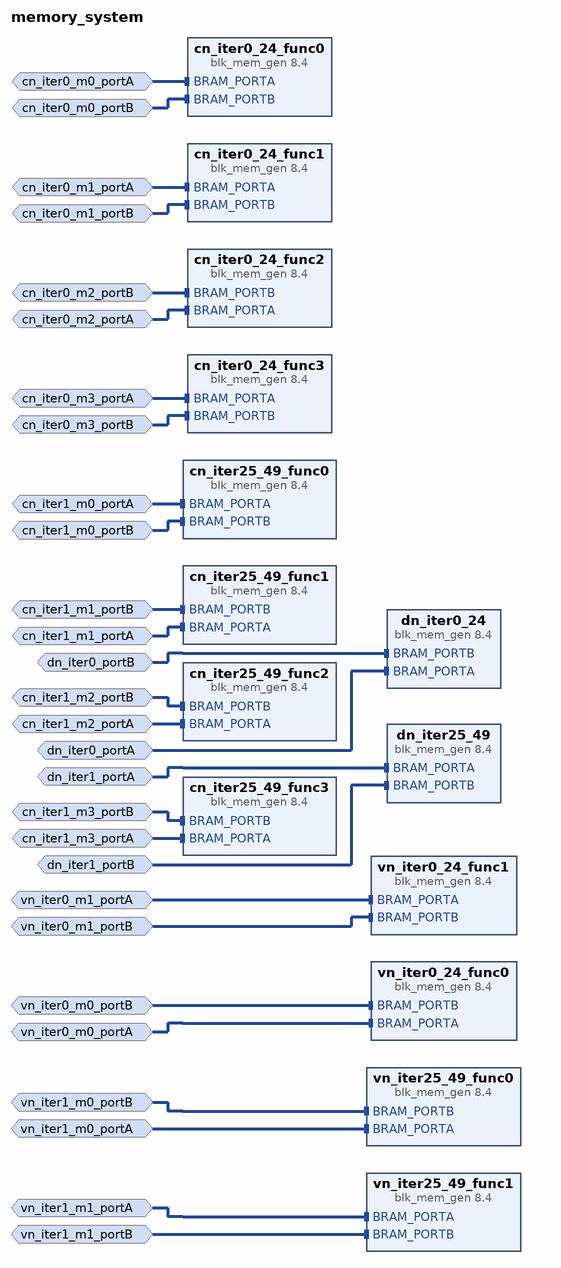
[diagram p0: block diagram of the top level]
# Vivado block design memory_system, xczu7ev-ffvc1156-2-e, Vivado 2019.2
create_bd_design memory_system

create_bd_intf_port -mode Slave -vlnv xilinx.com:interface:bram_rtl:1.0 cn_iter0_m0_portA
create_bd_intf_port -mode Slave -vlnv xilinx.com:interface:bram_rtl:1.0 cn_iter0_m0_portB
create_bd_intf_port -mode Slave -vlnv xilinx.com:interface:bram_rtl:1.0 cn_iter0_m1_portA
create_bd_intf_port -mode Slave -vlnv xilinx.com:interface:bram_rtl:1.0 cn_iter0_m1_portB
create_bd_intf_port -mode Slave -vlnv xilinx.com:interface:bram_rtl:1.0 cn_iter0_m2_portA
create_bd_intf_port -mode Slave -vlnv xilinx.com:interface:bram_rtl:1.0 cn_iter0_m2_portB
create_bd_intf_port -mode Slave -vlnv xilinx.com:interface:bram_rtl:1.0 cn_iter0_m3_portA
create_bd_intf_port -mode Slave -vlnv xilinx.com:interface:bram_rtl:1.0 cn_iter0_m3_portB
create_bd_intf_port -mode Slave -vlnv xilinx.com:interface:bram_rtl:1.0 cn_iter1_m0_portA
set_property -dict {CONFIG.READ_WRITE_MODE READ_ONLY} [get_bd_intf_ports cn_iter1_m0_portA]
create_bd_intf_port -mode Slave -vlnv xilinx.com:interface:bram_rtl:1.0 cn_iter1_m0_portB
set_property -dict {CONFIG.READ_WRITE_MODE READ_ONLY} [get_bd_intf_ports cn_iter1_m0_portB]
create_bd_intf_port -mode Slave -vlnv xilinx.com:interface:bram_rtl:1.0 cn_iter1_m1_portA
set_property -dict {CONFIG.READ_WRITE_MODE READ_ONLY} [get_bd_intf_ports cn_iter1_m1_portA]
create_bd_intf_port -mode Slave -vlnv xilinx.com:interface:bram_rtl:1.0 cn_iter1_m1_portB
set_property -dict {CONFIG.READ_WRITE_MODE READ_ONLY} [get_bd_intf_ports cn_iter1_m1_portB]
create_bd_intf_port -mode Slave -vlnv xilinx.com:interface:bram_rtl:1.0 cn_iter1_m2_portA
set_property -dict {CONFIG.READ_WRITE_MODE READ_ONLY} [get_bd_intf_ports cn_iter1_m2_portA]
create_bd_intf_port -mode Slave -vlnv xilinx.com:interface:bram_rtl:1.0 cn_iter1_m2_portB
set_property -dict {CONFIG.READ_WRITE_MODE READ_ONLY} [get_bd_intf_ports cn_iter1_m2_portB]
create_bd_intf_port -mode Slave -vlnv xilinx.com:interface:bram_rtl:1.0 cn_iter1_m3_portA
set_property -dict {CONFIG.READ_WRITE_MODE READ_ONLY} [get_bd_intf_ports cn_iter1_m3_portA]
create_bd_intf_port -mode Slave -vlnv xilinx.com:interface:bram_rtl:1.0 cn_iter1_m3_portB
set_property -dict {CONFIG.READ_WRITE_MODE READ_ONLY} [get_bd_intf_ports cn_iter1_m3_portB]
create_bd_intf_port -mode Slave -vlnv xilinx.com:interface:bram_rtl:1.0 dn_iter0_portA
set_property -dict {CONFIG.READ_WRITE_MODE READ_ONLY} [get_bd_intf_ports dn_iter0_portA]
create_bd_intf_port -mode Slave -vlnv xilinx.com:interface:bram_rtl:1.0 dn_iter0_portB
set_property -dict {CONFIG.READ_WRITE_MODE READ_ONLY} [get_bd_intf_ports dn_iter0_portB]
create_bd_intf_port -mode Slave -vlnv xilinx.com:interface:bram_rtl:1.0 dn_iter1_portA
set_property -dict {CONFIG.READ_WRITE_MODE READ_ONLY} [get_bd_intf_ports dn_iter1_portA]
create_bd_intf_port -mode Slave -vlnv xilinx.com:interface:bram_rtl:1.0 dn_iter1_portB
set_property -dict {CONFIG.READ_WRITE_MODE READ_ONLY} [get_bd_intf_ports dn_iter1_portB]
create_bd_intf_port -mode Slave -vlnv xilinx.com:interface:bram_rtl:1.0 vn_iter0_m0_portA
set_property -dict {CONFIG.READ_WRITE_MODE READ_ONLY} [get_bd_intf_ports vn_iter0_m0_portA]
create_bd_intf_port -mode Slave -vlnv xilinx.com:interface:bram_rtl:1.0 vn_iter0_m0_portB
set_property -dict {CONFIG.READ_WRITE_MODE READ_ONLY} [get_bd_intf_ports vn_iter0_m0_portB]
create_bd_intf_port -mode Slave -vlnv xilinx.com:interface:bram_rtl:1.0 vn_iter0_m1_portA
set_property -dict {CONFIG.READ_WRITE_MODE READ_ONLY} [get_bd_intf_ports vn_iter0_m1_portA]
create_bd_intf_port -mode Slave -vlnv xilinx.com:interface:bram_rtl:1.0 vn_iter0_m1_portB
set_property -dict {CONFIG.READ_WRITE_MODE READ_ONLY} [get_bd_intf_ports vn_iter0_m1_portB]
create_bd_intf_port -mode Slave -vlnv xilinx.com:interface:bram_rtl:1.0 vn_iter1_m0_portA
set_property -dict {CONFIG.READ_WRITE_MODE READ_ONLY} [get_bd_intf_ports vn_iter1_m0_portA]
create_bd_intf_port -mode Slave -vlnv xilinx.com:interface:bram_rtl:1.0 vn_iter1_m0_portB
set_property -dict {CONFIG.READ_WRITE_MODE READ_ONLY} [get_bd_intf_ports vn_iter1_m0_portB]
create_bd_intf_port -mode Slave -vlnv xilinx.com:interface:bram_rtl:1.0 vn_iter1_m1_portA
set_property -dict {CONFIG.READ_WRITE_MODE READ_ONLY} [get_bd_intf_ports vn_iter1_m1_portA]
create_bd_intf_port -mode Slave -vlnv xilinx.com:interface:bram_rtl:1.0 vn_iter1_m1_portB
set_property -dict {CONFIG.READ_WRITE_MODE READ_ONLY} [get_bd_intf_ports vn_iter1_m1_portB]

create_bd_cell -type ip -vlnv xilinx.com:ip:blk_mem_gen:8.4 cn_iter0_24_func0
set_property -dict [list \
  CONFIG.Algorithm Minimum_Area \
  CONFIG.Assume_Synchronous_Clk true \
  CONFIG.Coe_File ../../../../../../../../python_prj/COE_BRAM32.CNU/Iter_0_24/lut_Iter0_24_Func0.coe \
  CONFIG.Enable_32bit_Address false \
  CONFIG.Enable_A Always_Enabled \
  CONFIG.Enable_B Always_Enabled \
  CONFIG.Load_Init_File true \
  CONFIG.Memory_Type Dual_Port_ROM \
  CONFIG.Port_A_Write_Rate 0 \
  CONFIG.Port_B_Clock 100 \
  CONFIG.Port_B_Enable_Rate 100 \
  CONFIG.RD_ADDR_CHNG_A false \
  CONFIG.Read_Width_B 6 \
  CONFIG.Register_PortA_Output_of_Memory_Primitives false \
  CONFIG.Register_PortB_Output_of_Memory_Primitives false \
  CONFIG.Use_RSTA_Pin false \
  CONFIG.Write_Depth_A 800 \
  CONFIG.Write_Width_A 6 \
  CONFIG.Write_Width_B 6 \
  CONFIG.use_bram_block Stand_Alone \
] [get_bd_cells cn_iter0_24_func0]
create_bd_cell -type ip -vlnv xilinx.com:ip:blk_mem_gen:8.4 cn_iter0_24_func1
set_property -dict [list \
  CONFIG.Algorithm Minimum_Area \
  CONFIG.Assume_Synchronous_Clk true \
  CONFIG.Coe_File ../../../../../../../../python_prj/COE_BRAM32.CNU/Iter_0_24/lut_Iter0_24_Func1.coe \
  CONFIG.Enable_32bit_Address false \
  CONFIG.Enable_A Always_Enabled \
  CONFIG.Enable_B Always_Enabled \
  CONFIG.Load_Init_File true \
  CONFIG.Memory_Type Dual_Port_ROM \
  CONFIG.Port_A_Write_Rate 0 \
  CONFIG.Port_B_Clock 100 \
  CONFIG.Port_B_Enable_Rate 100 \
  CONFIG.RD_ADDR_CHNG_A false \
  CONFIG.Read_Width_B 6 \
  CONFIG.Register_PortA_Output_of_Memory_Primitives false \
  CONFIG.Register_PortB_Output_of_Memory_Primitives false \
  CONFIG.Use_RSTA_Pin false \
  CONFIG.Write_Depth_A 800 \
  CONFIG.Write_Width_A 6 \
  CONFIG.Write_Width_B 6 \
  CONFIG.use_bram_block Stand_Alone \
] [get_bd_cells cn_iter0_24_func1]
create_bd_cell -type ip -vlnv xilinx.com:ip:blk_mem_gen:8.4 cn_iter0_24_func2
set_property -dict [list \
  CONFIG.Algorithm Minimum_Area \
  CONFIG.Assume_Synchronous_Clk true \
  CONFIG.Coe_File ../../../../../../../../python_prj/COE_BRAM32.CNU/Iter_0_24/lut_Iter0_24_Func2.coe \
  CONFIG.Enable_32bit_Address false \
  CONFIG.Enable_A Always_Enabled \
  CONFIG.Enable_B Always_Enabled \
  CONFIG.Load_Init_File true \
  CONFIG.Memory_Type Dual_Port_ROM \
  CONFIG.Port_A_Write_Rate 0 \
  CONFIG.Port_B_Clock 100 \
  CONFIG.Port_B_Enable_Rate 100 \
  CONFIG.RD_ADDR_CHNG_A false \
  CONFIG.Read_Width_B 6 \
  CONFIG.Register_PortA_Output_of_Memory_Primitives false \
  CONFIG.Register_PortB_Output_of_Memory_Primitives false \
  CONFIG.Use_RSTA_Pin false \
  CONFIG.Write_Depth_A 800 \
  CONFIG.Write_Width_A 6 \
  CONFIG.Write_Width_B 6 \
  CONFIG.use_bram_block Stand_Alone \
] [get_bd_cells cn_iter0_24_func2]
create_bd_cell -type ip -vlnv xilinx.com:ip:blk_mem_gen:8.4 cn_iter0_24_func3
set_property -dict [list \
  CONFIG.Algorithm Minimum_Area \
  CONFIG.Assume_Synchronous_Clk true \
  CONFIG.Coe_File ../../../../../../../../python_prj/COE_BRAM32.CNU/Iter_0_24/lut_Iter0_24_Func3.coe \
  CONFIG.Enable_32bit_Address false \
  CONFIG.Enable_A Always_Enabled \
  CONFIG.Enable_B Always_Enabled \
  CONFIG.Load_Init_File true \
  CONFIG.Memory_Type Dual_Port_ROM \
  CONFIG.Port_A_Write_Rate 0 \
  CONFIG.Port_B_Clock 100 \
  CONFIG.Port_B_Enable_Rate 100 \
  CONFIG.RD_ADDR_CHNG_A false \
  CONFIG.Read_Width_B 6 \
  CONFIG.Register_PortA_Output_of_Memory_Primitives false \
  CONFIG.Register_PortB_Output_of_Memory_Primitives false \
  CONFIG.Use_RSTA_Pin false \
  CONFIG.Write_Depth_A 800 \
  CONFIG.Write_Width_A 6 \
  CONFIG.Write_Width_B 6 \
  CONFIG.use_bram_block Stand_Alone \
] [get_bd_cells cn_iter0_24_func3]
create_bd_cell -type ip -vlnv xilinx.com:ip:blk_mem_gen:8.4 cn_iter25_49_func0
set_property -dict [list \
  CONFIG.Algorithm Minimum_Area \
  CONFIG.Assume_Synchronous_Clk true \
  CONFIG.Coe_File ../../../../../../../../python_prj/COE_BRAM32.CNU/Iter_25_49/lut_Iter25_49_Func0.coe \
  CONFIG.Enable_32bit_Address false \
  CONFIG.Enable_A Always_Enabled \
  CONFIG.Enable_B Always_Enabled \
  CONFIG.Load_Init_File true \
  CONFIG.Memory_Type Dual_Port_ROM \
  CONFIG.Port_A_Write_Rate 0 \
  CONFIG.Port_B_Clock 100 \
  CONFIG.Port_B_Enable_Rate 100 \
  CONFIG.RD_ADDR_CHNG_A false \
  CONFIG.Read_Width_B 6 \
  CONFIG.Register_PortA_Output_of_Memory_Primitives false \
  CONFIG.Register_PortB_Output_of_Memory_Primitives false \
  CONFIG.Use_RSTA_Pin false \
  CONFIG.Write_Depth_A 800 \
  CONFIG.Write_Width_A 6 \
  CONFIG.Write_Width_B 6 \
  CONFIG.use_bram_block Stand_Alone \
] [get_bd_cells cn_iter25_49_func0]
create_bd_cell -type ip -vlnv xilinx.com:ip:blk_mem_gen:8.4 cn_iter25_49_func1
set_property -dict [list \
  CONFIG.Algorithm Minimum_Area \
  CONFIG.Assume_Synchronous_Clk true \
  CONFIG.Coe_File ../../../../../../../../python_prj/COE_BRAM32.CNU/Iter_25_49/lut_Iter25_49_Func1.coe \
  CONFIG.Enable_32bit_Address false \
  CONFIG.Enable_A Always_Enabled \
  CONFIG.Enable_B Always_Enabled \
  CONFIG.Load_Init_File true \
  CONFIG.Memory_Type Dual_Port_ROM \
  CONFIG.Port_A_Write_Rate 0 \
  CONFIG.Port_B_Clock 100 \
  CONFIG.Port_B_Enable_Rate 100 \
  CONFIG.RD_ADDR_CHNG_A false \
  CONFIG.Read_Width_B 6 \
  CONFIG.Register_PortA_Output_of_Memory_Primitives false \
  CONFIG.Register_PortB_Output_of_Memory_Primitives false \
  CONFIG.Use_RSTA_Pin false \
  CONFIG.Write_Depth_A 800 \
  CONFIG.Write_Width_A 6 \
  CONFIG.Write_Width_B 6 \
  CONFIG.use_bram_block Stand_Alone \
] [get_bd_cells cn_iter25_49_func1]
create_bd_cell -type ip -vlnv xilinx.com:ip:blk_mem_gen:8.4 cn_iter25_49_func3
set_property -dict [list \
  CONFIG.Algorithm Minimum_Area \
  CONFIG.Assume_Synchronous_Clk true \
  CONFIG.Coe_File ../../../../../../../../python_prj/COE_BRAM32.CNU/Iter_25_49/lut_Iter25_49_Func3.coe \
  CONFIG.Enable_32bit_Address false \
  CONFIG.Enable_A Always_Enabled \
  CONFIG.Enable_B Always_Enabled \
  CONFIG.Load_Init_File true \
  CONFIG.Memory_Type Dual_Port_ROM \
  CONFIG.Port_A_Write_Rate 0 \
  CONFIG.Port_B_Clock 100 \
  CONFIG.Port_B_Enable_Rate 100 \
  CONFIG.RD_ADDR_CHNG_A false \
  CONFIG.Read_Width_B 6 \
  CONFIG.Register_PortA_Output_of_Memory_Primitives false \
  CONFIG.Register_PortB_Output_of_Memory_Primitives false \
  CONFIG.Use_RSTA_Pin false \
  CONFIG.Write_Depth_A 800 \
  CONFIG.Write_Width_A 6 \
  CONFIG.Write_Width_B 6 \
  CONFIG.use_bram_block Stand_Alone \
] [get_bd_cells cn_iter25_49_func3]
create_bd_cell -type ip -vlnv xilinx.com:ip:blk_mem_gen:8.4 cn_iter25_49_func2
set_property -dict [list \
  CONFIG.Algorithm Minimum_Area \
  CONFIG.Assume_Synchronous_Clk true \
  CONFIG.Coe_File ../../../../../../../../python_prj/COE_BRAM32.CNU/Iter_25_49/lut_Iter25_49_Func2.coe \
  CONFIG.Enable_32bit_Address false \
  CONFIG.Enable_A Always_Enabled \
  CONFIG.Enable_B Always_Enabled \
  CONFIG.Load_Init_File true \
  CONFIG.Memory_Type Dual_Port_ROM \
  CONFIG.Port_A_Write_Rate 0 \
  CONFIG.Port_B_Clock 100 \
  CONFIG.Port_B_Enable_Rate 100 \
  CONFIG.RD_ADDR_CHNG_A false \
  CONFIG.Read_Width_B 6 \
  CONFIG.Register_PortA_Output_of_Memory_Primitives false \
  CONFIG.Register_PortB_Output_of_Memory_Primitives false \
  CONFIG.Use_RSTA_Pin false \
  CONFIG.Write_Depth_A 800 \
  CONFIG.Write_Width_A 6 \
  CONFIG.Write_Width_B 6 \
  CONFIG.use_bram_block Stand_Alone \
] [get_bd_cells cn_iter25_49_func2]
create_bd_cell -type ip -vlnv xilinx.com:ip:blk_mem_gen:8.4 vn_iter0_24_func0
set_property -dict [list \
  CONFIG.Algorithm Minimum_Area \
  CONFIG.Assume_Synchronous_Clk true \
  CONFIG.Coe_File ../../../../../../../../python_prj/COE_BRAM32.VNU/Iter_0_24/lut_Iter0_24_Func0.coe \
  CONFIG.Enable_32bit_Address false \
  CONFIG.Enable_A Always_Enabled \
  CONFIG.Enable_B Always_Enabled \
  CONFIG.Load_Init_File true \
  CONFIG.Memory_Type Dual_Port_ROM \
  CONFIG.Port_A_Write_Rate 0 \
  CONFIG.Port_B_Clock 100 \
  CONFIG.Port_B_Enable_Rate 100 \
  CONFIG.RD_ADDR_CHNG_A false \
  CONFIG.Read_Width_B 8 \
  CONFIG.Register_PortA_Output_of_Memory_Primitives false \
  CONFIG.Register_PortB_Output_of_Memory_Primitives false \
  CONFIG.Use_RSTA_Pin false \
  CONFIG.Write_Depth_A 1600 \
  CONFIG.Write_Width_A 8 \
  CONFIG.Write_Width_B 8 \
  CONFIG.use_bram_block Stand_Alone \
] [get_bd_cells vn_iter0_24_func0]
create_bd_cell -type ip -vlnv xilinx.com:ip:blk_mem_gen:8.4 vn_iter0_24_func1
set_property -dict [list \
  CONFIG.Algorithm Minimum_Area \
  CONFIG.Assume_Synchronous_Clk true \
  CONFIG.Coe_File ../../../../../../../../python_prj/COE_BRAM32.VNU/Iter_0_24/lut_Iter0_24_Func1.coe \
  CONFIG.Enable_32bit_Address false \
  CONFIG.Enable_A Always_Enabled \
  CONFIG.Enable_B Always_Enabled \
  CONFIG.Load_Init_File true \
  CONFIG.Memory_Type Dual_Port_ROM \
  CONFIG.Port_A_Write_Rate 0 \
  CONFIG.Port_B_Clock 100 \
  CONFIG.Port_B_Enable_Rate 100 \
  CONFIG.RD_ADDR_CHNG_A false \
  CONFIG.Read_Width_B 8 \
  CONFIG.Register_PortA_Output_of_Memory_Primitives false \
  CONFIG.Register_PortB_Output_of_Memory_Primitives false \
  CONFIG.Use_RSTA_Pin false \
  CONFIG.Write_Depth_A 1600 \
  CONFIG.Write_Width_A 8 \
  CONFIG.Write_Width_B 8 \
  CONFIG.use_bram_block Stand_Alone \
] [get_bd_cells vn_iter0_24_func1]
create_bd_cell -type ip -vlnv xilinx.com:ip:blk_mem_gen:8.4 vn_iter25_49_func0
set_property -dict [list \
  CONFIG.Algorithm Minimum_Area \
  CONFIG.Assume_Synchronous_Clk true \
  CONFIG.Coe_File ../../../../../../../../python_prj/COE_BRAM32.VNU/Iter_25_49/lut_Iter25_49_Func0.coe \
  CONFIG.Enable_32bit_Address false \
  CONFIG.Enable_A Always_Enabled \
  CONFIG.Enable_B Always_Enabled \
  CONFIG.Load_Init_File true \
  CONFIG.Memory_Type Dual_Port_ROM \
  CONFIG.Port_A_Write_Rate 0 \
  CONFIG.Port_B_Clock 100 \
  CONFIG.Port_B_Enable_Rate 100 \
  CONFIG.RD_ADDR_CHNG_A false \
  CONFIG.Read_Width_B 8 \
  CONFIG.Register_PortA_Output_of_Memory_Primitives false \
  CONFIG.Register_PortB_Output_of_Memory_Primitives false \
  CONFIG.Use_RSTA_Pin false \
  CONFIG.Write_Depth_A 1600 \
  CONFIG.Write_Width_A 8 \
  CONFIG.Write_Width_B 8 \
  CONFIG.use_bram_block Stand_Alone \
] [get_bd_cells vn_iter25_49_func0]
create_bd_cell -type ip -vlnv xilinx.com:ip:blk_mem_gen:8.4 vn_iter25_49_func1
set_property -dict [list \
  CONFIG.Algorithm Minimum_Area \
  CONFIG.Assume_Synchronous_Clk true \
  CONFIG.Coe_File ../../../../../../../../python_prj/COE_BRAM32.VNU/Iter_25_49/lut_Iter25_49_Func1.coe \
  CONFIG.Enable_32bit_Address false \
  CONFIG.Enable_A Always_Enabled \
  CONFIG.Enable_B Always_Enabled \
  CONFIG.Load_Init_File true \
  CONFIG.Memory_Type Dual_Port_ROM \
  CONFIG.Port_A_Write_Rate 0 \
  CONFIG.Port_B_Clock 100 \
  CONFIG.Port_B_Enable_Rate 100 \
  CONFIG.RD_ADDR_CHNG_A false \
  CONFIG.Read_Width_B 8 \
  CONFIG.Register_PortA_Output_of_Memory_Primitives false \
  CONFIG.Register_PortB_Output_of_Memory_Primitives false \
  CONFIG.Use_RSTA_Pin false \
  CONFIG.Write_Depth_A 1600 \
  CONFIG.Write_Width_A 8 \
  CONFIG.Write_Width_B 8 \
  CONFIG.use_bram_block Stand_Alone \
] [get_bd_cells vn_iter25_49_func1]
create_bd_cell -type ip -vlnv xilinx.com:ip:blk_mem_gen:8.4 dn_iter0_24
set_property -dict [list \
  CONFIG.Algorithm Minimum_Area \
  CONFIG.Assume_Synchronous_Clk true \
  CONFIG.Coe_File ../../../../../../../../python_prj/COE_BRAM32.DNU/Iter_0_24/lut_Iter0_24_Func2.coe \
  CONFIG.Enable_32bit_Address false \
  CONFIG.Enable_A Always_Enabled \
  CONFIG.Enable_B Always_Enabled \
  CONFIG.Load_Init_File true \
  CONFIG.Memory_Type Dual_Port_ROM \
  CONFIG.Port_A_Write_Rate 0 \
  CONFIG.Port_B_Clock 100 \
  CONFIG.Port_B_Enable_Rate 100 \
  CONFIG.RD_ADDR_CHNG_A false \
  CONFIG.Read_Width_B 2 \
  CONFIG.Register_PortA_Output_of_Memory_Primitives false \
  CONFIG.Register_PortB_Output_of_Memory_Primitives false \
  CONFIG.Use_RSTA_Pin false \
  CONFIG.Write_Depth_A 1600 \
  CONFIG.Write_Width_A 2 \
  CONFIG.Write_Width_B 2 \
  CONFIG.use_bram_block Stand_Alone \
] [get_bd_cells dn_iter0_24]
create_bd_cell -type ip -vlnv xilinx.com:ip:blk_mem_gen:8.4 dn_iter25_49
set_property -dict [list \
  CONFIG.Algorithm Minimum_Area \
  CONFIG.Assume_Synchronous_Clk true \
  CONFIG.Coe_File ../../../../../../../../python_prj/COE_BRAM32.DNU/Iter_25_49/lut_Iter25_49_Func2.coe \
  CONFIG.Enable_32bit_Address false \
  CONFIG.Enable_A Always_Enabled \
  CONFIG.Enable_B Always_Enabled \
  CONFIG.Load_Init_File true \
  CONFIG.Memory_Type Dual_Port_ROM \
  CONFIG.Port_A_Write_Rate 0 \
  CONFIG.Port_B_Clock 100 \
  CONFIG.Port_B_Enable_Rate 100 \
  CONFIG.RD_ADDR_CHNG_A false \
  CONFIG.Read_Width_B 2 \
  CONFIG.Register_PortA_Output_of_Memory_Primitives false \
  CONFIG.Register_PortB_Output_of_Memory_Primitives false \
  CONFIG.Use_RSTA_Pin false \
  CONFIG.Write_Depth_A 1600 \
  CONFIG.Write_Width_A 2 \
  CONFIG.Write_Width_B 2 \
  CONFIG.use_bram_block Stand_Alone \
] [get_bd_cells dn_iter25_49]

# ---- connections ----

connect_bd_intf_net -intf_net BRAM_PORTA_3_1 [get_bd_intf_ports cn_iter0_m3_portA] [get_bd_intf_pins cn_iter0_24_func3/BRAM_PORTA]
connect_bd_intf_net -intf_net BRAM_PORTB_2_1 [get_bd_intf_ports cn_iter0_m2_portB] [get_bd_intf_pins cn_iter0_24_func2/BRAM_PORTB]
connect_bd_intf_net -intf_net BRAM_PORTB_4_2 [get_bd_intf_ports vn_iter1_m0_portB] [get_bd_intf_pins vn_iter25_49_func0/BRAM_PORTB]
connect_bd_intf_net -intf_net BRAM_PORTA_3_2 [get_bd_intf_ports vn_iter0_m1_portA] [get_bd_intf_pins vn_iter0_24_func1/BRAM_PORTA]
connect_bd_intf_net -intf_net BRAM_PORTA_4_1 [get_bd_intf_ports cn_iter1_m0_portA] [get_bd_intf_pins cn_iter25_49_func0/BRAM_PORTA]
connect_bd_intf_net -intf_net BRAM_PORTB_6_1 [get_bd_intf_ports cn_iter1_m2_portB] [get_bd_intf_pins cn_iter25_49_func2/BRAM_PORTB]
connect_bd_intf_net -intf_net BRAM_PORTA_4_2 [get_bd_intf_ports vn_iter1_m0_portA] [get_bd_intf_pins vn_iter25_49_func0/BRAM_PORTA]
connect_bd_intf_net -intf_net BRAM_PORTA_1_2 [get_bd_intf_ports dn_iter1_portA] [get_bd_intf_pins dn_iter25_49/BRAM_PORTA]
connect_bd_intf_net -intf_net BRAM_PORTA_6_1 [get_bd_intf_ports cn_iter1_m2_portA] [get_bd_intf_pins cn_iter25_49_func2/BRAM_PORTA]
connect_bd_intf_net -intf_net BRAM_PORTA_5_2 [get_bd_intf_ports vn_iter1_m1_portA] [get_bd_intf_pins vn_iter25_49_func1/BRAM_PORTA]
connect_bd_intf_net -intf_net BRAM_PORTA_0_1 [get_bd_intf_ports cn_iter0_m0_portA] [get_bd_intf_pins cn_iter0_24_func0/BRAM_PORTA]
connect_bd_intf_net -intf_net BRAM_PORTB_5_1 [get_bd_intf_ports cn_iter1_m1_portB] [get_bd_intf_pins cn_iter25_49_func1/BRAM_PORTB]
connect_bd_intf_net -intf_net BRAM_PORTA_5_1 [get_bd_intf_ports cn_iter1_m1_portA] [get_bd_intf_pins cn_iter25_49_func1/BRAM_PORTA]
connect_bd_intf_net -intf_net BRAM_PORTB_0_1 [get_bd_intf_ports cn_iter0_m0_portB] [get_bd_intf_pins cn_iter0_24_func0/BRAM_PORTB]
connect_bd_intf_net -intf_net BRAM_PORTB_3_1 [get_bd_intf_ports cn_iter0_m3_portB] [get_bd_intf_pins cn_iter0_24_func3/BRAM_PORTB]
connect_bd_intf_net -intf_net BRAM_PORTB_7_1 [get_bd_intf_ports cn_iter1_m3_portB] [get_bd_intf_pins cn_iter25_49_func3/BRAM_PORTB]
connect_bd_intf_net -intf_net BRAM_PORTA_1_1 [get_bd_intf_ports cn_iter0_m1_portA] [get_bd_intf_pins cn_iter0_24_func1/BRAM_PORTA]
connect_bd_intf_net -intf_net BRAM_PORTB_1_2 [get_bd_intf_ports dn_iter1_portB] [get_bd_intf_pins dn_iter25_49/BRAM_PORTB]
connect_bd_intf_net -intf_net BRAM_PORTA_7_1 [get_bd_intf_ports cn_iter1_m3_portA] [get_bd_intf_pins cn_iter25_49_func3/BRAM_PORTA]
connect_bd_intf_net -intf_net BRAM_PORTA_2_1 [get_bd_intf_ports cn_iter0_m2_portA] [get_bd_intf_pins cn_iter0_24_func2/BRAM_PORTA]
connect_bd_intf_net -intf_net BRAM_PORTB_0_2 [get_bd_intf_ports dn_iter0_portB] [get_bd_intf_pins dn_iter0_24/BRAM_PORTB]
connect_bd_intf_net -intf_net BRAM_PORTB_3_2 [get_bd_intf_ports vn_iter0_m1_portB] [get_bd_intf_pins vn_iter0_24_func1/BRAM_PORTB]
connect_bd_intf_net -intf_net BRAM_PORTB_2_2 [get_bd_intf_ports vn_iter0_m0_portB] [get_bd_intf_pins vn_iter0_24_func0/BRAM_PORTB]
connect_bd_intf_net -intf_net BRAM_PORTB_1_1 [get_bd_intf_ports cn_iter0_m1_portB] [get_bd_intf_pins cn_iter0_24_func1/BRAM_PORTB]
connect_bd_intf_net -intf_net BRAM_PORTB_4_1 [get_bd_intf_ports cn_iter1_m0_portB] [get_bd_intf_pins cn_iter25_49_func0/BRAM_PORTB]
connect_bd_intf_net -intf_net BRAM_PORTA_2_2 [get_bd_intf_ports vn_iter0_m0_portA] [get_bd_intf_pins vn_iter0_24_func0/BRAM_PORTA]
connect_bd_intf_net -intf_net BRAM_PORTA_0_2 [get_bd_intf_ports dn_iter0_portA] [get_bd_intf_pins dn_iter0_24/BRAM_PORTA]
connect_bd_intf_net -intf_net BRAM_PORTB_5_2 [get_bd_intf_ports vn_iter1_m1_portB] [get_bd_intf_pins vn_iter25_49_func1/BRAM_PORTB]

validate_bd_design
save_bd_design
